# Altium project Nixie Imponator.PrjPcb
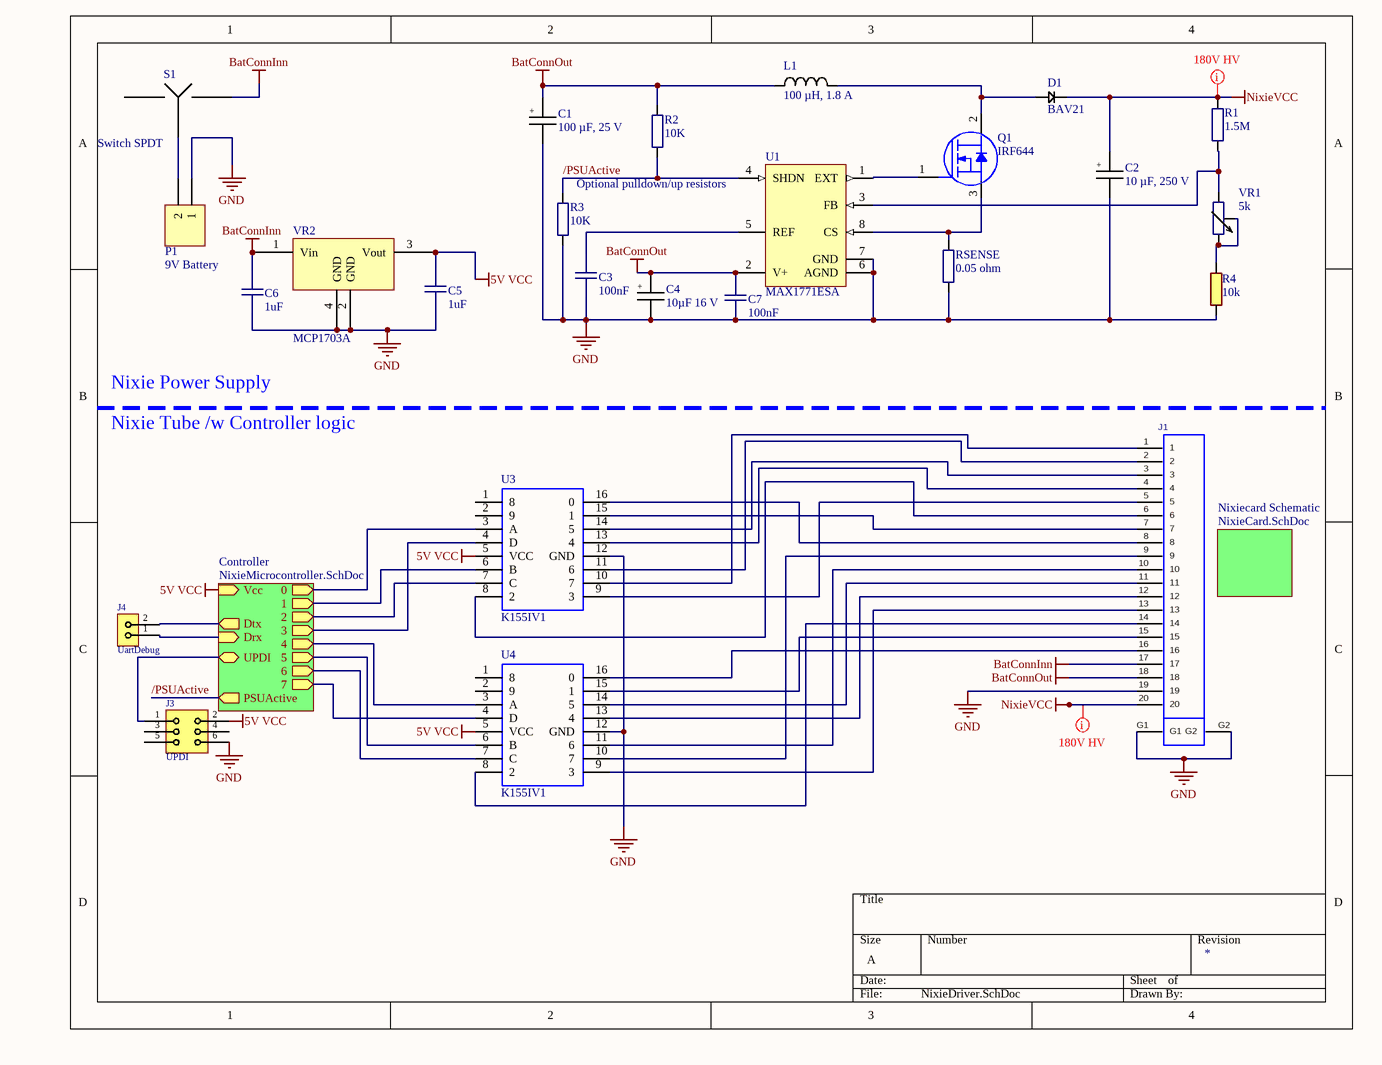
[diagram p0: NixieDriver.SchDoc, right]
3 sheets, 34 parts. Net scope: hierarchical (ports join the sheet entries above them; power ports are global).
Board files: PCB1.PcbDoc, PCB2.PcbDoc
Sheets:
  NixieDriver.SchDoc
    Controller = NixieMicrocontroller.SchDoc
    Nixiecard Schematic = NixieCard.SchDoc

## Sheet NixieDriver.SchDoc: OmegaV Nixie Imponator
size A; Author: Ole Sivert Aarhaug

### Parts
C1  100 µF, 25 V  [CAPAE9583X65M]
C2  10 µF, 250 V  [CAPAE112103X170M]
C3  100nF  [CAPC0805(2012)100_N]
C4  10µF 16 V  [CAPAE5542X55M]
C5  1uF  [CAPC0805(2012)100_N]
C6  1uF  [CAPC0805(2012)100_N]
C7  100nF  [CAPC0805(2012)100_N]
D1  BAV21  [DO-41]
J1  ZF1-20-01-XX-WT  [ZF1-20-01-XX-WT]  (value not drawn)
J3  UPDI  [HDRV6W64P254_2X3_762X508X900B]
J4  UartDebug  [HDRV2W64P254_1X2_508X254X900B]
L1  100 µH, 1.8 A  [B82479A1]
P1  9V Battery  [HDR1X2]
Q1  IRF644  [TO-220-3P]
R1  1.5M  [RC2512]
R2  10K  [R0805]
R3  10K  [R0805]
R4  10k  [RESC0805(2012)_N]
RSENSE  0.05 ohm  [LR2010]
S1  Switch SPDT  [3TH]
U1  MAX1771ESA  [S8-5_L]
U3  K155IV1  [CircuitWorks-DIP16]
U4  K155IV1  [CircuitWorks-DIP16]
VR1  5k  [PVG3A trimpot]
VR2  MCP1703A  [SOT230P700X180-4N]

### Sub-sheets
Controller = NixieMicrocontroller.SchDoc: 0 (out), 1 (out), 2 (out), 3 (out), 4 (out), 5 (out), 6 (out), 7 (out), Vcc (in), Dtx (out), Drx (in), UPDI (bidir), PSUActive (out)
Nixiecard Schematic = NixieCard.SchDoc: no entries

### Nets
5V VCC: C5.2 J3.2(VCC) U3.5(VCC) U4.5(VCC) VR2.3(Vout) ; sheet Controller/Vcc
BatConnInn: C6.2 J1.17 S1.3(K) VR2.1(Vin)
BatConnOut: C1.1 C4.1 C7.1 J1.18 L1.1 R2.2 U1.2(V+)
GND: C1.2 C2.2 C3.1 C4.2 C5.1 C6.1 C7.2 J1.19 J1.G1 J1.G2 J3.6(GND) P1.1 R3.1 R4.1 RSENSE.1 U1.6(AGND) U1.7(GND) U3.12(GND) U4.12(GND) VR2.2(GND) VR2.4(GND)
NixieVCC: C2.1 D1.2(K) J1.20 R1.2
/PSUActive: R2.1 R3.2 U1.4(SHDN) ; sheet Controller/PSUActive
NetC3_2: C3.2 U1.5(REF)
NetD1_1: D1.1(A) L1.2 Q1.2(Source)
NetJ1_1: J1.1 U3.10(7)
NetJ1_2: J1.2 U3.11(6)
NetJ1_3: J1.3 U3.14(5)
NetJ1_4: J1.4 U3.13(4)
NetJ1_5: J1.5 U3.9(3)
NetJ1_6: J1.6 U3.8(2)
NetJ1_7: J1.7 U3.15(1)
NetJ1_8: J1.8 U3.16(0)
NetJ1_9: J1.9 U4.10(7)
NetJ1_10: J1.10 U4.11(6)
NetJ1_11: J1.11 U4.14(5)
NetJ1_12: J1.12 U4.13(4)
NetJ1_13: J1.13 U4.9(3)
NetJ1_14: J1.14 U4.8(2)
NetJ1_15: J1.15 U4.15(1)
NetJ1_16: J1.16 U4.16(0)
NetJ3_1: J3.1(UDPI) ; sheet Controller/UPDI
NetJ4_1: J4.1 ; sheet Controller/Drx
NetJ4_2: J4.2 ; sheet Controller/Dtx
NetP1_2: P1.2 S1.2(K)
NetQ1_1: Q1.1(Gate) U1.1(EXT)
NetQ1_3: Q1.3(Drain) RSENSE.2 U1.8(CS)
NetR1_1: R1.1 U1.3(FB) VR1.3
NetR4_2: R4.2 VR1.1 VR1.2
NetU2_10: U3.3(A) ; sheet Controller/0
NetU2_11: U3.6(B) ; sheet Controller/1
NetU2_12: U3.7(C) ; sheet Controller/2
NetU2_13: U3.4(D) ; sheet Controller/3
NetU2_16: U4.3(A) ; sheet Controller/4
NetU2_17: U4.6(B) ; sheet Controller/5
NetU2_18: U4.7(C) ; sheet Controller/6
NetU2_19: U4.4(D) ; sheet Controller/7

Not connected (* = marked no-connect by the designer): J3 3 4 5; S1 1(K); U3 1(8) 2(9); U4 1(8) 2(9)

### Layout directives
net class HV: NixieVCC

### Notes on the sheet
- (near U1) Optional pulldown/up resistors
- Nixie Power Supply
- Nixie Tube /w Controller logic
- (in symbol EEEFC1C100R) +
- (in symbol EEEFK1E101P) +
- (in symbol EEVEB2E100Q) +

### Library data of the parts
C1 = EEEFK1E101P: ComponentLink1Description: farnell; ComponentLink1URL: https://no.farnell.com/panasonic/eeefk1e101p/cap-100-f-25v-radial-smd/dp/9695770
C2 = EEVEB2E100Q: ComponentLink1Description: Farnell; ComponentLink1URL: https://no.farnell.com/panasonic/eeveb2e100q/cap-10-f-250v-radial-smd/dp/2326345?st=eeveb2e100q; ComponentLink2Description: Datasheet; ComponentLink2URL: http://www.farnell.com/datasheets/2245254.pdf; Parameter 1: *
C3 C7 = 2445: X7R 50V; id: 2445; rad: 1; rom: OV; lager_type: Fremlager; dybde: 4; hylle: 6; antall: 50; kolonne: 3; pakke_opprettet_av: 815; leverandor_varenr: 2408556; nokkelord: Kondensator, capacitor; produsent: Multikomp; leverandor: Farnell; pakketype: 0805; pakke_opprettet: 14.11.2014 20:52:01; symbol_opprettet_av: 815; symbol_opprettet: 14.11.2014 20:19:34; navn: 100nF; pris: 1
C4 = EEEFC1C100R: ComponentLink1Description: farnell; ComponentLink1URL: https://no.farnell.com/panasonic/eeefc1c100r/cap-10-f-16v-radial-smd/dp/9693491
C5 C6 = 3582: X7R 50V 10%; id: 3582; pakke_opprettet_av: 815; leverandor_varenr: 1735541; pris: 4; nokkelord: Kondensator, capacitor; produsent: Murata; leverandor: Farnell; pakketype: 0805; pakke_opprettet: 14.11.2014 20:52:01; symbol_opprettet_av: 815; symbol_opprettet: 14.11.2014 20:19:34; navn: 1uF
D1 = 1290
J1 = ZF1-20-01-XX-WT: ZERO INSERTION FORCE 1mm ASSEMBLY, BOTTOM CONTACT.
J3 = 3187: id: 3187; pakke_opprettet_av: 815; beskrivelse: 2,54mm pitch; navn: Header 2x3; pris: 3; pakketype: TH; pakke_opprettet: 23.07.2015 20:17:54; symbol_opprettet_av: 815; symbol_opprettet: 13.11.2014 11:03:43
J4 = 2429: id: 2429; pakke_opprettet_av: 815; beskrivelse: 2,54mm pitch; navn: Header 1x2; pris: 1; pakketype: TH; pakke_opprettet: 13.11.2014 12:30:48; symbol_opprettet_av: 815; symbol_opprettet: 13.11.2014 10:58:53
L1 = B82479A1104M
P1 = Header 2: Header, 2-Pin; LatestRevisionDate: 17-Jul-2002; LatestRevisionNote: Re-released for DXP Platform.; Publisher: Altium Limited
Q1 = 4730: Power MOSFET; id: 4730; pakke_opprettet_av: 815; pris: 0; nokkelord: power mosfet, transistor; produsent: Vishay; pakketype: TO-220; pakke_opprettet: 09.06.2015 21:08:41; symbol_opprettet_av: 815; symbol_opprettet: 14.09.2016 15:31:38; navn: IRF644; ComponentLink1Description: farnell; ComponentLink1URL: https://no.farnell.com/vishay/irf644pbf/mosfet-n-250v-14a-to-220/dp/8648409?scope=partnumberlookahead&ost=IRF644PBF&searchref=searchlookahead&exaMfpn=true&ddkey=https%3Ano-NO%2FElement14_Norway%2Fw%2Fsearch
R1-R3 RSENSE = Resistor: ComponentLink1Description: farnell
  R1: ComponentLink1URL: https://no.farnell.com/yageo/rc2512jk-071m5l/res-1m5-5-1w-2512-thick-film/dp/9236058?rpsku=rel3:3258142&isexcsku=false#
  R2 R3 RSENSE: ComponentLink1URL: https://no.farnell.com/tt-electronics-welwyn/lr2010-r05fw/res-0r05-1-1w-2010-thick-film/dp/1100050
R4 = 3584: 0.1W 1% Thick film resistor; id: 3584; pakke_opprettet_av: 815; navn: 1k; pris: 0; nokkelord: Resistor Motstand; produsent: Multikomp; leverandor: Farnell; pakketype: 0805; pakke_opprettet: 27.01.2016 14:23:16; symbol_opprettet_av: 815; symbol_opprettet: 08.07.2014 21:16:33
U1 = CMP-0246-00656-1: 12 V or Adjustable Output, High-Efficiency, Low IQ, Step-Up DC-DC Controller, -40 to 85 degC, 8-Pin SOIC (S8-5), RoHS; Manufacturer: Maxim; VIN: 3 to 16.5 V; Shutdown Current: 5 uA Max.; Preset Vout: 12 V; Supply Current: 110 uA Max.; Reference Voltage: 1.5 V; Mounting Technology: Surface Mount; PackageReference: S8-5; PackageDescription: 8-Pin Small Outline Integrated Circuit Package, Body 4.9 x 3.9 mm, Pitch 1.27 mm; ComponentLink3Description: Package Specification; ComponentLink3URL: http://pdfserv.maximintegrated.com/package_dwgs/21-0041.PDF; ComponentLink2Description: Datasheet; ComponentLink1URL: http://www.maximintegrated.com/; DatasheetVersion: Rev. 2; PackageVersion: Rev. E; RoHS: TRUE; ComponentLink1Description: Manufacturer URL; PartNumber: MAX1771ESA; ComponentLink2URL: http://datasheets.maximintegrated.com/en/ds/MAX1771.pdf; Temperature Range: -40 to 85 degC
U3 U4 = 1463: id: 1463; pakke_opprettet_av: 1607; symbol_opprettet_av: 2099; beskrivelse: Nixie tube driver (K155NB1); pris: 5; pakketype: TH; pakke_opprettet: 25.08.2016 00:00:22; symbol_opprettet: 10.10.2018 20:11:59; navn: K155IV1
VR1 = PVG3A502C01R00: ComponentLink1Description: farnell; ComponentLink1URL: https://no.farnell.com/bourns/pvg3a502c01r00/trimmer-pot-5k-1turn-smd/dp/2709479
VR2 = MCP1703A: ComponentLink1Description: datasheet; ComponentLink1URL: http://ww1.microchip.com/downloads/en/DeviceDoc/20005122B.pdf; ComponentLink2Description: farnell; ComponentLink2URL: https://no.farnell.com/microchip/mcp1703a-5002e-db/ldo-16vin-0-25a-5v-2-3sot223/dp/2113889?st=MCP1703A

## Sheet NixieMicrocontroller.SchDoc
size A4
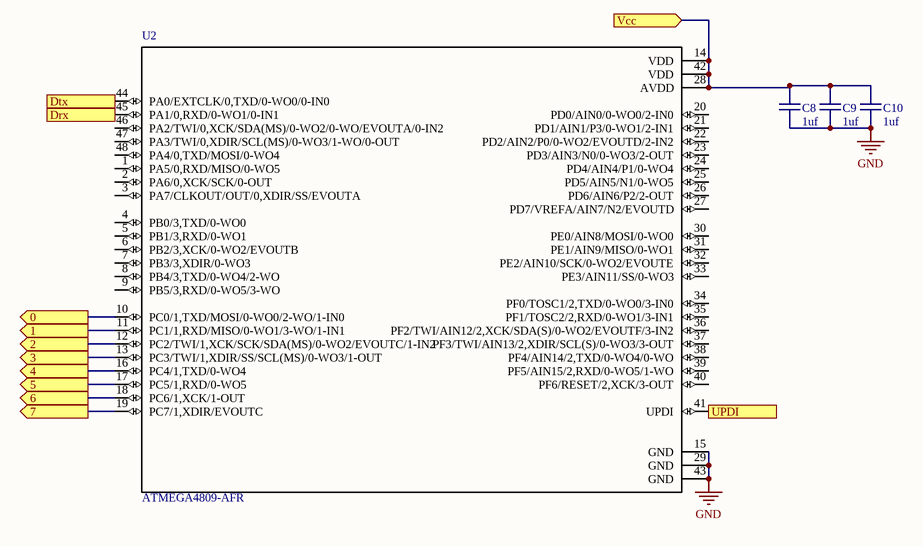
[diagram p1: NixieMicrocontroller.SchDoc]

### Parts
C8  1uf  [CAPC0805(2012)100_N]
C9  1uf  [CAPC0805(2012)100_N]
C10  1uf  [CAPC0805(2012)100_N]
U2  ATMEGA4809-AFR  [*QFP50P900X900X120-48N]

### Ports
0 (out), 1 (out), 2 (out), 3 (out), 4 (out), 5 (out), 6 (out), 7 (out), Drx (in), Dtx (out), UPDI, Vcc (in)

### Nets
5V VCC: C8.2 C9.2 C10.2 U2.14(VDD) U2.28(AVDD) U2.42(VDD) ; port Vcc
GND: C8.1 C9.1 C10.1 U2.15(GND) U2.29(GND) U2.43(GND)
NetJ3_1: U2.41(UPDI) ; port UPDI
NetJ4_1: U2.45(PA1/0,RXD/0-WO1/0-IN1) ; port Drx
NetJ4_2: U2.44(PA0/EXTCLK/0,TXD/0-WO0/0-IN0) ; port Dtx
NetU2_10: U2.10(PC0/1,TXD/MOSI/0-WO0/2-WO/1-IN0) ; port 0
NetU2_11: U2.11(PC1/1,RXD/MISO/0-WO1/3-WO/1-IN1) ; port 1
NetU2_12: U2.12(PC2/TWI/1,XCK/SCK/SDA(MS)/0-WO2/EVOUTC/1-IN2) ; port 2
NetU2_13: U2.13(PC3/TWI/1,XDIR/SS/SCL(MS)/0-WO3/1-OUT) ; port 3
NetU2_16: U2.16(PC4/1,TXD/0-WO4) ; port 4
NetU2_17: U2.17(PC5/1,RXD/0-WO5) ; port 5
NetU2_18: U2.18(PC6/1,XCK/1-OUT) ; port 6
NetU2_19: U2.19(PC7/1,XDIR/EVOUTC) ; port 7

Not connected (* = marked no-connect by the designer): U2 1(PA5/0,RXD/MISO/0-WO5) 2(PA6/0,XCK/SCK/0-OUT) 3(PA7/CLKOUT/OUT/0,XDIR/SS/EVOUTA) 4(PB0/3,TXD/0-WO0) 5(PB1/3,RXD/0-WO1) 6(PB2/3,XCK/0-WO2/EVOUTB) 7(PB3/3,XDIR/0-WO3) 8(PB4/3,TXD/0-WO4/2-WO) 9(PB5/3,RXD/0-WO5/3-WO) 20(PD0/AIN0/0-WO0/2-IN0) 21(PD1/AIN1/P3/0-WO1/2-IN1) 22(PD2/AIN2/P0/0-WO2/EVOUTD/2-IN2) 23(PD3/AIN3/N0/0-WO3/2-OUT) 24(PD4/AIN4/P1/0-WO4) 25(PD5/AIN5/N1/0-WO5) 26(PD6/AIN6/P2/2-OUT) 27(PD7/VREFA/AIN7/N2/EVOUTD) 30(PE0/AIN8/MOSI/0-WO0) 31(PE1/AIN9/MISO/0-WO1) 32(PE2/AIN10/SCK/0-WO2/EVOUTE) 33(PE3/AIN11/SS/0-WO3) 34(PF0/TOSC1/2,TXD/0-WO0/3-IN0) 35(PF1/TOSC2/2,RXD/0-WO1/3-IN1) 36(PF2/TWI/AIN12/2,XCK/SDA(S)/0-WO2/EVOUTF/3-IN2) 37(PF3/TWI/AIN13/2,XDIR/SCL(S)/0-WO3/3-OUT) 38(PF4/AIN14/2,TXD/0-WO4/0-WO) 39(PF5/AIN15/2,RXD/0-WO5/1-WO) 40(PF6/RESET/2,XCK/3-OUT) 46(PA2/TWI/0,XCK/SDA(MS)/0-WO2/0-WO/EVOUTA/0-IN2) 47(PA3/TWI/0,XDIR/SCL(MS)/0-WO3/1-WO/0-OUT) 48(PA4/0,TXD/MOSI/0-WO4)

### Library data of the parts
C8-C10 = 2445: X7R 50V; id: 2445; rad: 1; rom: OV; lager_type: Fremlager; dybde: 4; hylle: 6; antall: 50; kolonne: 3; pakke_opprettet_av: 815; leverandor_varenr: 2408556; navn: 100nF; nokkelord: Kondensator, capacitor; produsent: Multikomp; leverandor: Farnell; pakketype: 0805; pakke_opprettet: 14.11.2014 20:52:01; symbol_opprettet_av: 815; symbol_opprettet: 14.11.2014 20:19:34; pris: 1
U2 = ATMEGA4809-AFR: 20MHz 48KB TQFP48 Ind 125C Green T&R; MF: Microchip; Package: TQFP-48 Microchip; Price: None; MP: ATMEGA4809-AFR; SnapEDA_Link: https://www.snapeda.com/parts/ATMEGA4809-AFR/Microchip/view-part/?ref=snap; Availability: Unavailable; Value: *

## Sheet NixieCard.SchDoc
size A
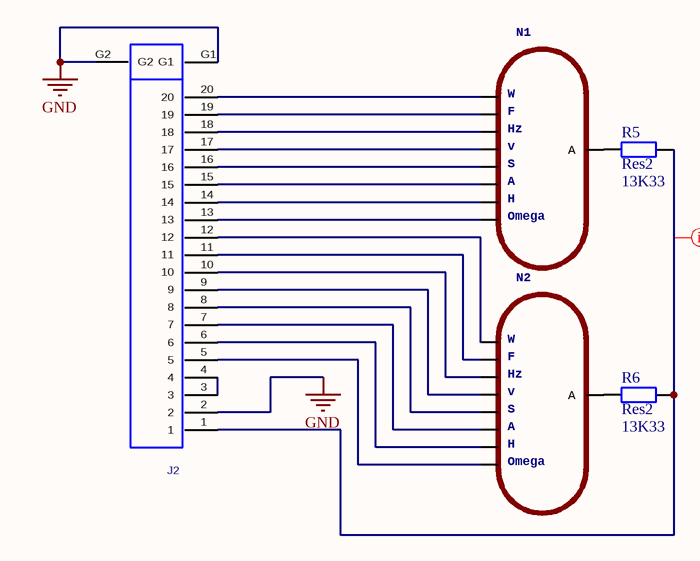
[diagram p2: NixieCard.SchDoc]

### Parts
J2  ZF1-20-01-XX-WT  [ZF1-20-01-XX-WT]  (value not drawn)
N1  IN-15B  [IN-12]  (value not drawn)
N2  IN-15B  [IN-12]  (value not drawn)
R5  Res2  value 13K33  [AXIAL-0.4]
R6  Res2  value 13K33  [AXIAL-0.4]

### Nets
GND: J2.2 J2.G1 J2.G2
NetJ2_1: J2.1 R5.1 R6.1
NetJ2_3: J2.3 J2.4
NetJ2_5: J2.5 N2.2(P$8)
NetJ2_6: J2.6 N2.6(P$7)
NetJ2_7: J2.7 N2.1(P$6)
NetJ2_8: J2.8 N2.4(P$5)
NetJ2_9: J2.9 N2.5(P$4)
NetJ2_10: J2.10 N2.7(P$3)
NetJ2_11: J2.11 N2.9(P$2)
NetJ2_12: J2.12 N2.0(P$1)
NetJ2_13: J2.13 N1.2(P$8)
NetJ2_14: J2.14 N1.6(P$7)
NetJ2_15: J2.15 N1.1(P$6)
NetJ2_16: J2.16 N1.4(P$5)
NetJ2_17: J2.17 N1.5(P$4)
NetJ2_18: J2.18 N1.7(P$3)
NetJ2_19: J2.19 N1.9(P$2)
NetJ2_20: J2.20 N1.0(P$1)
NetN1_A: N1.A R5.2
NetN2_A: N2.A R6.2

### Layout directives
net class HV: NetJ2_1

### Library data of the parts
J2 = ZF1-20-01-XX-WT: as J1 on sheet NixieDriver
N1 N2 = IN-15B: IN-15B: medium symbol topview nixie tube; Hz: Hz; W: W; v: v; A: A; S: S; H: H; Omega: Omega; F: F
R5 R6 = Res2: Resistor; Published: 8-Jun-2000; LatestRevisionDate: 17-Jul-2002; LatestRevisionNote: Re-released for DXP Platform.; PackageReference: AXIAL-0.4; Publisher: Altium Limited; PackageDescription: Axial Device, Thru-Hole; 2 Leads; 0.4 in Pin Spacing

## Nets that join several sheets
5V VCC: NixieDriver (5 pins), NixieMicrocontroller (6 pins)
GND: NixieDriver (21 pins), NixieMicrocontroller (6 pins), NixieCard (J2.2 J2.G1 J2.G2)
NetJ3_1: NixieDriver (J3.1), NixieMicrocontroller (U2.41)
NetJ4_1: NixieDriver (J4.1), NixieMicrocontroller (U2.45)
NetJ4_2: NixieDriver (J4.2), NixieMicrocontroller (U2.44)
NetU2_10: NixieDriver (U3.3), NixieMicrocontroller (U2.10)
NetU2_11: NixieDriver (U3.6), NixieMicrocontroller (U2.11)
NetU2_12: NixieDriver (U3.7), NixieMicrocontroller (U2.12)
NetU2_13: NixieDriver (U3.4), NixieMicrocontroller (U2.13)
NetU2_16: NixieDriver (U4.3), NixieMicrocontroller (U2.16)
NetU2_17: NixieDriver (U4.6), NixieMicrocontroller (U2.17)
NetU2_18: NixieDriver (U4.7), NixieMicrocontroller (U2.18)
NetU2_19: NixieDriver (U4.4), NixieMicrocontroller (U2.19)